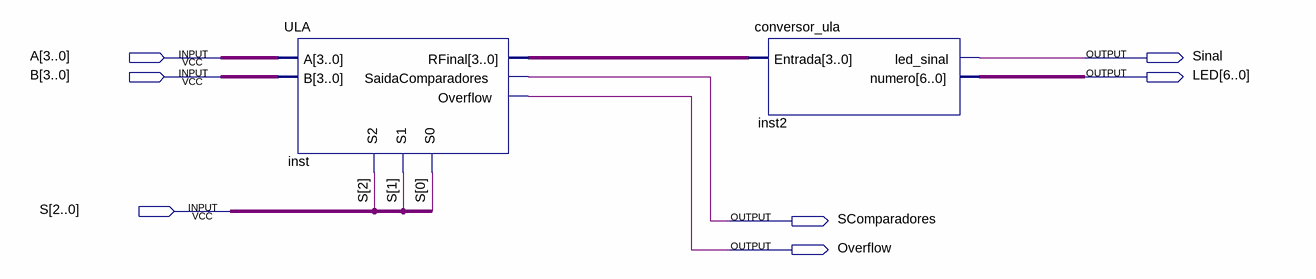
[diagram p0: schematic sheet]
// Quartus schematic MAIN.bdf as structural Verilog: 2 symbols, 7 pins
module MAIN (
  input  [3:0] A,
  input  [3:0] B,
  input  [2:0] S,
  output Sinal,
  output [6:0] LED,
  output SComparadores,
  output Overflow
);

  wire [3:0] inst_rfinal;

  ULA inst (
    .A(A), .B(B), .S0(S[0]), .S1(S[1]), .S2(S[2]), .RFinal(inst_rfinal), .SaidaComparadores(SComparadores),
    .Overflow(Overflow));
  conversor_ula inst2 (.Entrada(inst_rfinal), .led_sinal(Sinal), .numero(LED));
endmodule
